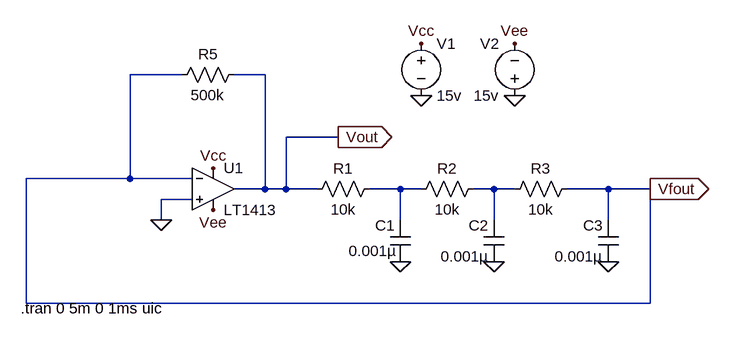
[diagram p0: schematic PHASESHIFT_OSCILLATOR.asc]
PHASESHIFT_OSCILLATOR.asc, the LTspice schematic file:
Version 4
SHEET 1 980 680
WIRE -96 -96 -176 -96
WIRE 32 -96 -16 -96
WIRE 144 0 64 0
WIRE -176 64 -176 -96
WIRE -176 64 -336 64
WIRE -80 64 -176 64
WIRE 32 80 32 -96
WIRE 32 80 -16 80
WIRE 64 80 64 0
WIRE 64 80 32 80
WIRE 112 80 64 80
WIRE 240 80 192 80
WIRE 272 80 240 80
WIRE 384 80 352 80
WIRE 416 80 384 80
WIRE 560 80 496 80
WIRE 624 80 560 80
WIRE -80 96 -128 96
WIRE -128 128 -128 96
WIRE 240 128 240 80
WIRE 384 128 384 80
WIRE 560 128 560 80
WIRE -336 256 -336 64
WIRE 624 256 624 80
WIRE 624 256 -336 256
FLAG 272 -64 0
FLAG 416 -64 0
FLAG 272 -144 Vcc
FLAG 416 -144 Vee
FLAG 144 0 Vout
IOPIN 144 0 Out
FLAG 624 80 Vfout
IOPIN 624 80 Out
FLAG -48 48 Vcc
FLAG -48 112 Vee
FLAG -128 128 0
FLAG 240 192 0
FLAG 384 192 0
FLAG 560 192 0
SYMBOL OpAmps\\LT1413 -48 16 R0
SYMATTR InstName U1
SYMBOL voltage 272 -160 R0
WINDOW 123 0 0 Left 0
WINDOW 39 0 0 Left 0
SYMATTR InstName V1
SYMATTR Value 15v
SYMBOL voltage 416 -48 R180
WINDOW 0 24 96 Left 2
WINDOW 3 24 16 Left 2
WINDOW 123 0 0 Left 0
WINDOW 39 0 0 Left 0
SYMATTR InstName V2
SYMATTR Value 15v
SYMBOL res 96 96 R270
WINDOW 0 32 56 VTop 2
WINDOW 3 0 56 VBottom 2
SYMATTR InstName R1
SYMATTR Value 10k
SYMBOL res 256 96 R270
WINDOW 0 32 56 VTop 2
WINDOW 3 0 56 VBottom 2
SYMATTR InstName R2
SYMATTR Value 10k
SYMBOL res 400 96 R270
WINDOW 0 32 56 VTop 2
WINDOW 3 0 56 VBottom 2
SYMATTR InstName R3
SYMATTR Value 10k
SYMBOL res 0 -112 R90
WINDOW 0 0 56 VBottom 2
WINDOW 3 32 56 VTop 2
SYMATTR InstName R5
SYMATTR Value 500k
SYMBOL cap 256 192 R180
WINDOW 0 24 56 Left 2
WINDOW 3 21 17 Left 2
SYMATTR InstName C1
SYMATTR Value 0.001µ
SYMBOL cap 400 192 R180
WINDOW 0 24 56 Left 2
WINDOW 3 24 8 Left 2
SYMATTR InstName C2
SYMATTR Value 0.001µ
SYMBOL cap 576 192 R180
WINDOW 0 24 56 Left 2
WINDOW 3 24 8 Left 2
SYMATTR InstName C3
SYMATTR Value 0.001µ
TEXT -344 264 Left 2 !.tran 0 5m 0 1ms uic

The netlist it stands for:
* PHASESHIFT_OSCILLATOR.asc
XU1 0 Vfout Vcc Vee Vout LT1413  ; pins In+ In- V+ V- OUT
V1 Vcc 0 15v
V2 0 Vee 15v
R1 Vout N001 10k
R2 N001 N002 10k
R3 N002 Vfout 10k
R5 Vout Vfout 500k
C1 0 N001 0.001µ
C2 0 N002 0.001µ
C3 0 Vfout 0.001µ
.tran 0 5m 0 1ms uic
.lib LTC.lib
.backanno
.end